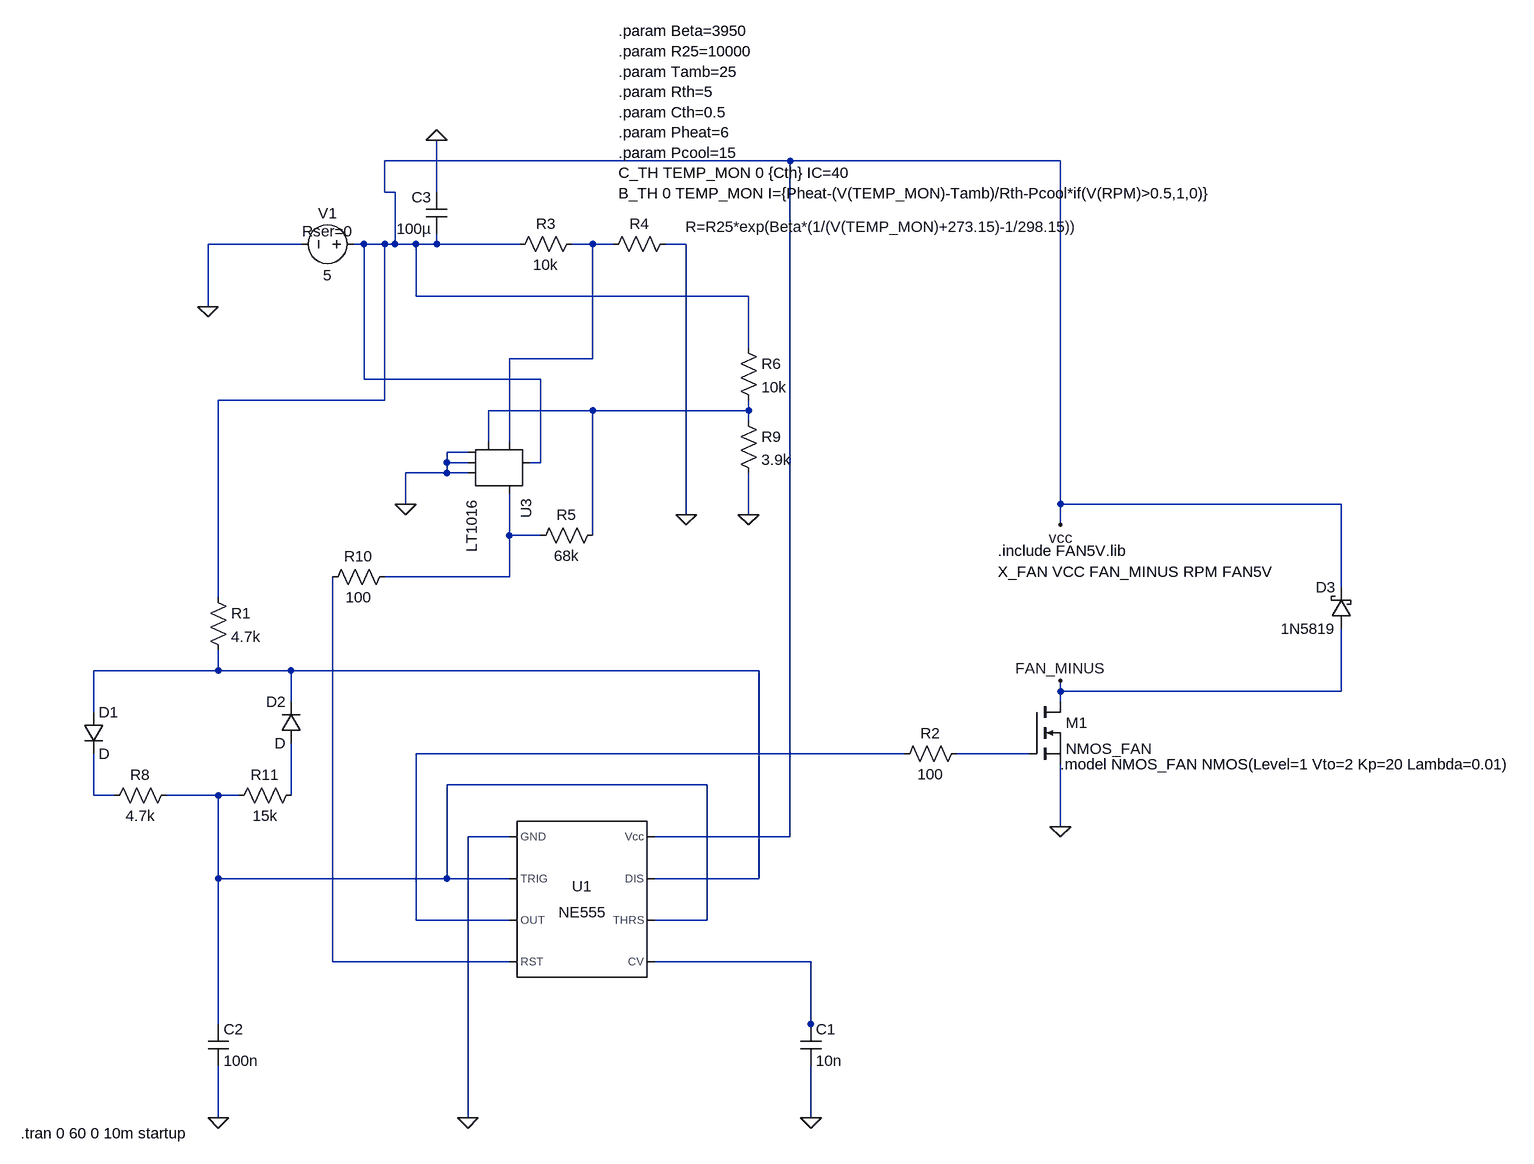
[diagram p0: schematic auto_ther_fan_모터냉각_온도피드백.asc]
auto_ther_fan_모터냉각_온도피드백.asc, the LTspice schematic file:
Version 4.1
SHEET 1 1544 680
WIRE 384 -928 -240 -928
WIRE 800 -928 384 -928
WIRE -240 -880 -240 -928
WIRE -224 -880 -240 -880
WIRE -160 -880 -160 -960
WIRE -368 -800 -512 -800
WIRE -272 -800 -288 -800
WIRE -240 -800 -272 -800
WIRE -224 -800 -224 -880
WIRE -224 -800 -240 -800
WIRE -192 -800 -224 -800
WIRE -160 -800 -160 -816
WIRE -160 -800 -192 -800
WIRE -32 -800 -160 -800
WIRE 80 -800 48 -800
WIRE 112 -800 80 -800
WIRE 224 -800 192 -800
WIRE -192 -720 -192 -800
WIRE 320 -720 -192 -720
WIRE -512 -704 -512 -800
WIRE 320 -640 320 -720
WIRE 80 -624 80 -800
WIRE 80 -624 -48 -624
WIRE -272 -592 -272 -800
WIRE 0 -592 -272 -592
WIRE -240 -560 -240 -800
WIRE -240 -560 -496 -560
WIRE 80 -544 -80 -544
WIRE 320 -544 320 -560
WIRE 320 -544 80 -544
WIRE 320 -528 320 -544
WIRE -80 -496 -80 -544
WIRE -48 -496 -48 -624
WIRE -112 -480 -144 -480
WIRE -144 -464 -144 -480
WIRE -112 -464 -144 -464
WIRE 0 -464 0 -592
WIRE 0 -464 -16 -464
WIRE -144 -448 -144 -464
WIRE -144 -448 -208 -448
WIRE -112 -448 -144 -448
WIRE -208 -400 -208 -448
WIRE 800 -400 800 -928
WIRE 1232 -400 800 -400
WIRE 224 -384 224 -800
WIRE 320 -384 320 -448
WIRE 800 -368 800 -400
WIRE -48 -352 -48 -416
WIRE 0 -352 -48 -352
WIRE 80 -352 80 -544
WIRE -48 -288 -48 -352
WIRE -48 -288 -240 -288
WIRE 1232 -272 1232 -400
WIRE -496 -256 -496 -560
WIRE -496 -144 -496 -176
WIRE -496 -144 -688 -144
WIRE -384 -144 -496 -144
WIRE 336 -144 -384 -144
WIRE 800 -112 800 -128
WIRE 1232 -112 1232 -208
WIRE 1232 -112 800 -112
WIRE -384 -96 -384 -144
WIRE 800 -96 800 -112
WIRE -688 -80 -688 -144
WIRE 560 -16 -192 -16
WIRE 752 -16 640 -16
WIRE 256 32 -144 32
WIRE -688 48 -688 -16
WIRE -656 48 -688 48
WIRE -496 48 -576 48
WIRE -464 48 -496 48
WIRE -384 48 -384 -32
WIRE 800 96 800 0
WIRE -48 112 -112 112
WIRE 384 112 384 -928
WIRE 384 112 176 112
WIRE -496 176 -496 48
WIRE -144 176 -144 32
WIRE -144 176 -496 176
WIRE -48 176 -144 176
WIRE 336 176 336 -144
WIRE 336 176 176 176
WIRE -192 240 -192 -16
WIRE -48 240 -192 240
WIRE 256 240 256 32
WIRE 256 240 176 240
WIRE -320 304 -320 -288
WIRE -48 304 -320 304
WIRE 416 304 176 304
WIRE -496 400 -496 176
WIRE 416 400 416 304
WIRE 416 416 416 400
WIRE -496 544 -496 464
WIRE -112 544 -112 112
WIRE 416 544 416 464
FLAG 416 544 0
FLAG -496 544 0
FLAG -112 544 0
FLAG 224 -384 0
FLAG -160 -960 0
FLAG 800 -368 vcc
FLAG 800 -128 FAN_MINUS
FLAG -512 -704 0
FLAG 320 -384 0
FLAG -208 -400 0
FLAG 800 96 0
SYMBOL Misc\\NE555 64 208 R0
SYMATTR InstName U1
SYMBOL cap 400 400 R0
SYMATTR InstName C1
SYMATTR Value 10n
SYMBOL cap -512 400 R0
SYMATTR InstName C2
SYMATTR Value 100n
SYMBOL diode -704 -80 R0
SYMATTR InstName D1
SYMBOL diode -368 -32 R180
WINDOW 0 24 64 Left 2
WINDOW 3 24 0 Left 2
SYMATTR InstName D2
SYMBOL nmos 752 -96 R0
SYMATTR InstName M1
SYMATTR Value NMOS_FAN
SYMBOL res -512 -272 R0
SYMATTR InstName R1
SYMATTR Value 4.7k
SYMBOL res 64 -816 R90
WINDOW 0 0 56 VBottom 2
WINDOW 3 32 56 VTop 2
SYMATTR InstName R3
SYMATTR Value 10k
SYMBOL voltage -272 -800 R90
WINDOW 0 -32 56 VBottom 2
WINDOW 3 32 56 VTop 2
WINDOW 123 0 0 Left 0
WINDOW 39 -4 56 VBottom 2
SYMATTR InstName V1
SYMATTR Value 5
SYMATTR SpiceLine Rser=0
SYMBOL res 208 -816 R90
WINDOW 0 0 56 VBottom 2
WINDOW 3 -26 -321 VTop 2
SYMATTR InstName R4
SYMATTR Value R=R25*exp(Beta*(1/(V(TEMP_MON)+273.15)-1/298.15))
SYMBOL Comparators\\LT1016 0 -464 R90
SYMATTR InstName U3
SYMBOL res 656 -32 R90
WINDOW 0 0 56 VBottom 2
WINDOW 3 32 56 VTop 2
SYMATTR InstName R2
SYMATTR Value 100
SYMBOL cap -144 -816 R180
WINDOW 0 24 56 Left 2
WINDOW 3 24 8 Left 2
SYMATTR InstName C3
SYMATTR Value 100µ
SYMBOL schottky 1248 -208 R180
WINDOW 0 24 64 Left 2
WINDOW 3 24 0 Left 2
SYMATTR InstName D3
SYMATTR Value 1N5819
SYMATTR Description Diode
SYMATTR Type diode
SYMBOL res 304 -656 R0
SYMATTR InstName R6
SYMATTR Value 10k
SYMBOL res 304 -544 R0
SYMATTR InstName R9
SYMATTR Value 3.9k
SYMBOL res -224 -304 R90
WINDOW 0 0 56 VBottom 2
WINDOW 3 32 56 VTop 2
SYMATTR InstName R10
SYMATTR Value 100
SYMBOL res 96 -368 R90
WINDOW 0 0 56 VBottom 2
WINDOW 3 32 56 VTop 2
SYMATTR InstName R5
SYMATTR Value 68k
SYMBOL res -560 32 R90
WINDOW 0 0 56 VBottom 2
WINDOW 3 32 56 VTop 2
SYMATTR InstName R8
SYMATTR Value 4.7k
SYMBOL res -368 32 R90
WINDOW 0 0 56 VBottom 2
WINDOW 3 32 56 VTop 2
SYMATTR InstName R11
SYMATTR Value 15k
TEXT 120 -1128 Left 2 !.param Beta=3950\n.param R25=10000\n.param Tamb=25\n.param Rth=5\n.param Cth=0.5\n.param Pheat=6\n.param Pcool=15\nC_TH TEMP_MON 0 {Cth} IC=40\nB_TH 0 TEMP_MON I={Pheat-(V(TEMP_MON)-Tamb)/Rth-Pcool*if(V(RPM)>0.5,1,0)}
TEXT -800 568 Left 2 !.tran 0 60 0 10m startup
TEXT 704 -328 Left 2 !.include FAN5V.lib
TEXT 704 -296 Left 2 !X_FAN VCC FAN_MINUS RPM FAN5V
TEXT 800 0 Left 2 !.model NMOS_FAN NMOS(Level=1 Vto=2 Kp=20 Lambda=0.01)

The netlist it stands for:
* auto_ther_fan_모터냉각_온도피드백.asc
X§U1 0 N007 N005 N010 N011 N007 N004 vcc NE555  ; pins GND TRIG OUT RST CV THRS DIS Vcc
C1 N011 0 10n
C2 N007 0 100n
D1 N004 N008 D
D2 N009 N004 D
M1 FAN_MINUS N006 0 0 NMOS_FAN
R1 vcc N004 4.7k
R3 N001 vcc 10k
V1 vcc 0 5 Rser=0
R4 0 N001 R=R25*exp(Beta*(1/(V(TEMP_MON)+273.15)-1/298.15))
X§U3 vcc N002 N001 0 0 0 N003 NC_01 LT1016
R2 N006 N005 100
C3 vcc 0 100µ
D3 FAN_MINUS vcc 1N5819
R6 vcc N002 10k
R9 N002 0 3.9k
R10 N003 N010 100
R5 N002 N003 68k
R8 N007 N008 4.7k
R11 N009 N007 15k
.model D D
.lib standard.dio
.model NMOS NMOS
.model PMOS PMOS
.lib standard.mos
.param Beta=3950
.param R25=10000
.param Tamb=25
.param Rth=5
.param Cth=0.5
.param Pheat=6
.param Pcool=15
C_TH TEMP_MON 0 {Cth} IC=40
B_TH 0 TEMP_MON I={Pheat-(V(TEMP_MON)-Tamb)/Rth-Pcool*if(V(RPM)>0.5,1,0)}
.tran 0 60 0 10m startup
.include FAN5V.lib
X_FAN VCC FAN_MINUS RPM FAN5V
.model NMOS_FAN NMOS(Level=1 Vto=2 Kp=20 Lambda=0.01)
.lib NE555.sub
.lib LTC.lib
.backanno
.end